# EAGLE design pc_healthypi_move_finger_sensor_v1 (EAGLE 9.6.2)
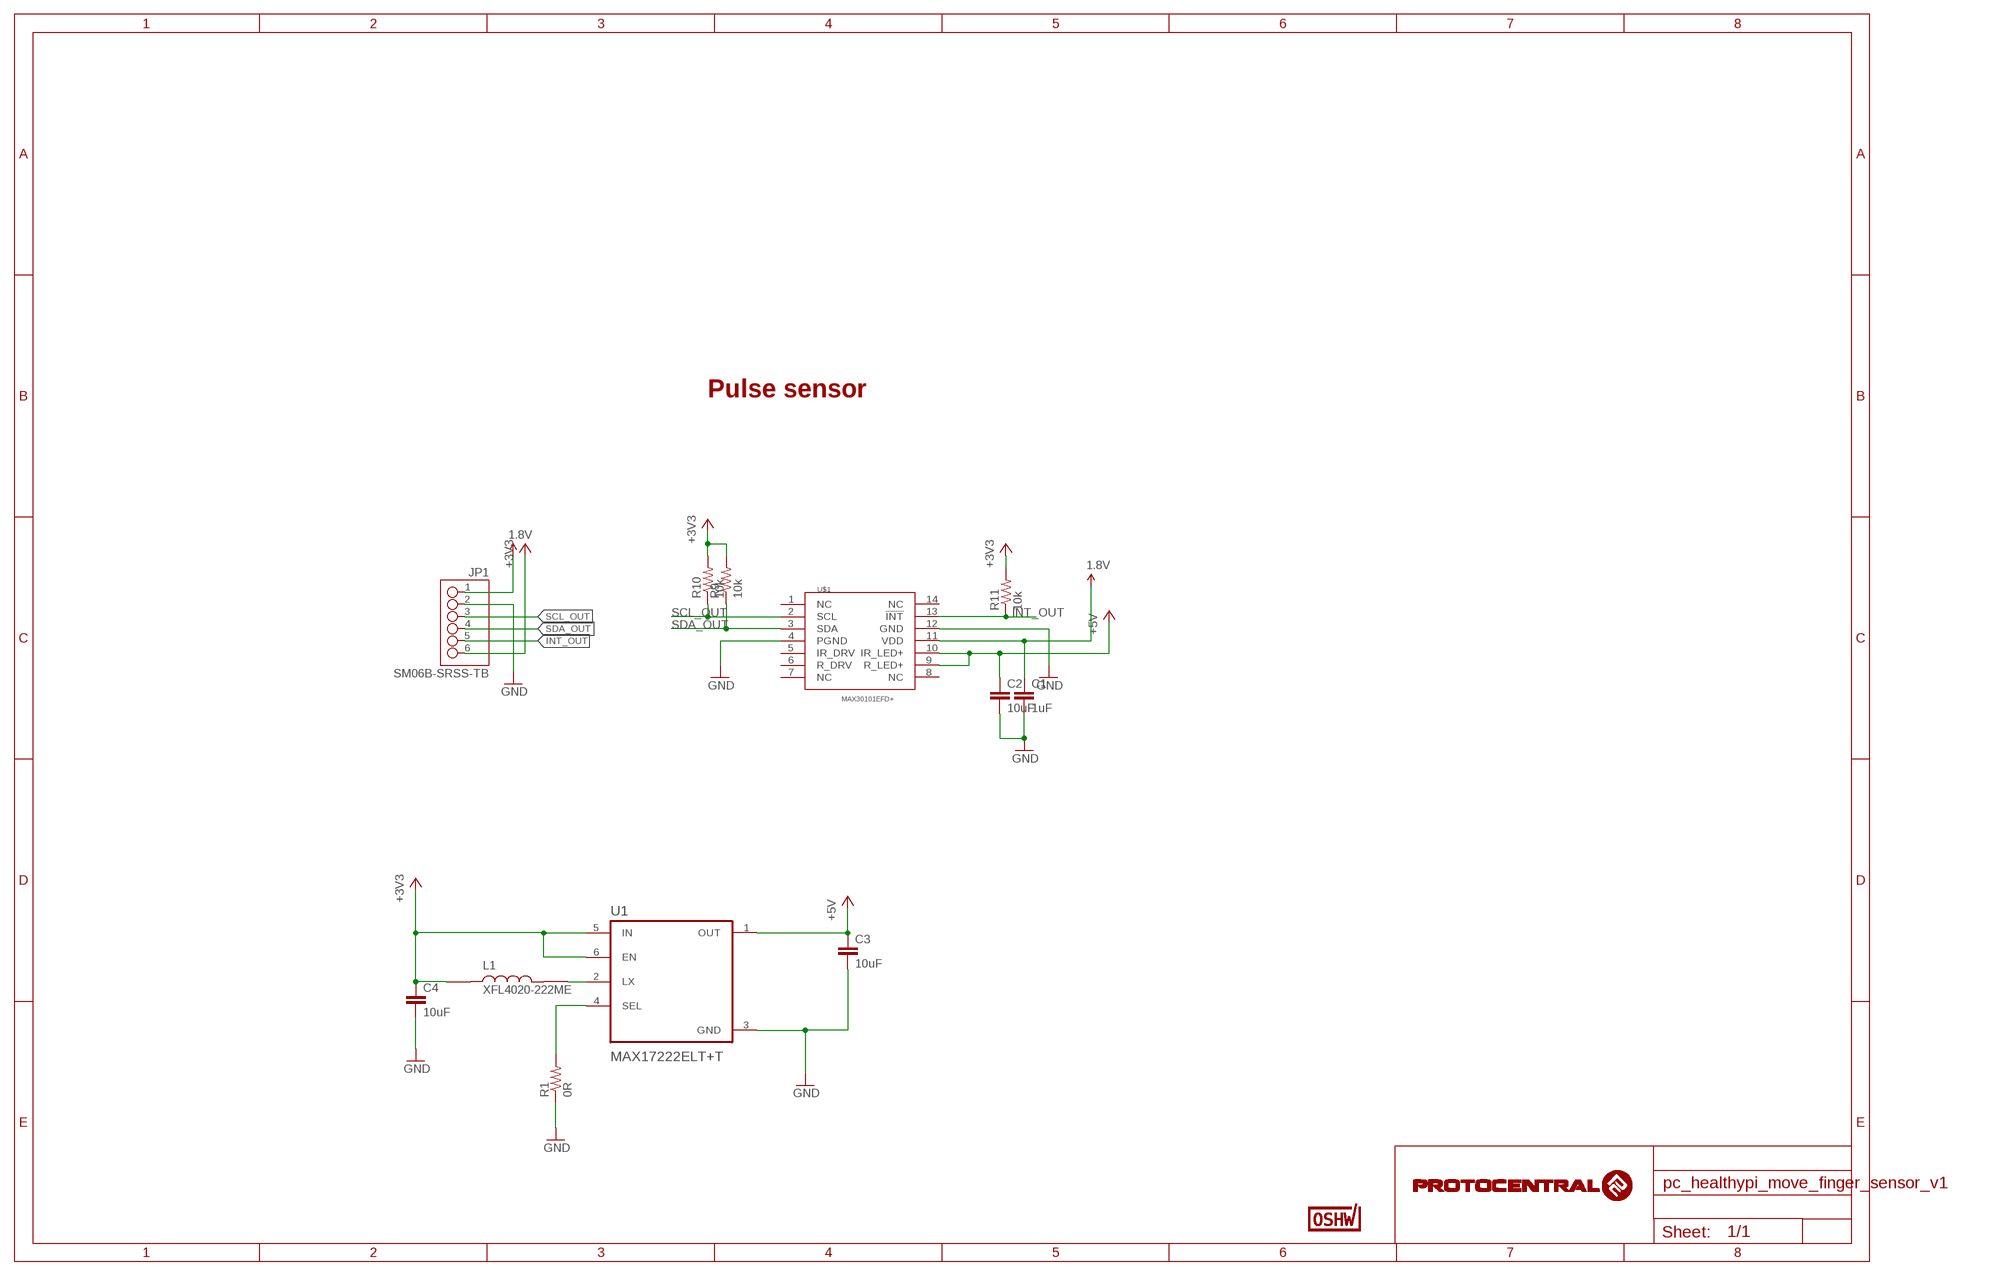
[diagram p0: schematic, sheet 1]

## Parts
C1  1uF  C-EUC0402  [C0402]
C2  10uF  C-EUC0402  [C0402]
C3  10uF  C-EUC0402  [C0402]
C4  10uF  C-EUC0402  [C0402]
JP1  SM06B-SRSS-TB  [SM06B-SRSS-TB]
L1  XFL4020-222ME  [IND_XFL4020-222ME]
R1  0R  R-US_R0402  [R0402]
R9  10k  R-US_R0402  [R0402]
R10  10k  R-US_R0402  [R0402]
R11  10k  R-US_R0402  [R0402]
U1  MAX17222ELT+T  [SON65P200X200X80-6N]
U$1  MAX30101EFD+  MAX30100  [OESIP-14]
U$9  CERT-SMALL  [CERT-SMALL-SILK]

## Nets
1.8V: C1.1 JP1.1 U$1.11(VDD)
+3V3: C4.1 JP1.6 L1.1 R9.2 R10.2 R11.2 U1.5(IN) U1.6(EN)
+5V: C2.1 C3.1 U1.1(OUT) U$1.9(R_LED+) U$1.10(IR_LED+)
GND: C1.2 C2.2 C3.2 C4.2 JP1.2 R1.1 U1.3(GND) U$1.4(PGND) U$1.12(GND)
INT_OUT: JP1.5 R11.1 U$1.13(!INT)
N$1: R1.2 U1.4(SEL)
N$2: L1.2 U1.2(LX)
SCL_OUT: JP1.3 R10.1 U$1.2(SCL)
SDA_OUT: JP1.4 R9.1 U$1.3(SDA)
Unconnected: U$1.1(NC) U$1.5(IR_DRV) U$1.6(R_DRV) U$1.7(NC) U$1.8(NC) U$1.14(NC)

## Notes on the sheet
- Pulse sensor

## Library data of the parts
C1-C4 = rcl:C-EU: CAPACITOR, European symbol; SPICEPREFIX: C
JP1 = circuitects:SM06B-SRSS-TB: Check availability <https://pricing.snapeda.com/parts/SM06B-SRSS-TB/JST%20Sales/view-part?ref=eda>; AVAILABILITY: In Stock; CHECK_PRICES: https://www.snapeda.com/parts/SM06B-SRSS-TB/JST+Sales+America+Inc./view-part/?ref=eda; DESCRIPTION: Connector Header Surface Mount, Right Angle 6 position 0.039 (1.00mm); MF: JST Sales; MP: SM06B-SRSS-TB; PACKAGE: None; PRICE: None; PURCHASE-URL: https://www.snapeda.com/api/url_track_click_mouser/?unipart_id=555083&manufacturer=JST Sales&part_name=SM06B-SRSS-TB&search_term=sm06b-srss-tb; SNAPEDA_LINK: https://www.snapeda.com/parts/SM06B-SRSS-TB/JST+Sales+America+Inc./view-part/?ref=snap
L1 = circuitects:XFL4020-222ME: Power inductor, shielded, 20% tol, SMT, RoHS, halogen free Check availability <https://pricing.snapeda.com/parts/XFL4020-222ME/Coilcraft/view-part?ref=eda>; AVAILABILITY: In Stock; CHECK_PRICES: https://www.snapeda.com/parts/XFL4020-222ME/Coilcraft/view-part/?ref=eda; DESCRIPTION: Power inductor, shielded, 20% tol, SMT, RoHS, halogen free; MF: Coilcraft; MP: XFL4020-222ME; PACKAGE: None; PRICE: None; SNAPEDA_LINK: https://www.snapeda.com/parts/XFL4020-222ME/Coilcraft/view-part/?ref=snap
R1 R9-R11 = rcl:R-US_: RESISTOR, American symbol; SPICEPREFIX: R
U1 = circuitects:MAX17222ELT+T: Check availability <https://pricing.snapeda.com/parts/MAX17222ELT%2BT/Analog%20Devices/view-part?ref=eda>; AVAILABILITY: In Stock; CHECK_PRICES: https://www.snapeda.com/parts/MAX17222ELT+T/Analog+Devices/view-part/?ref=eda; DESCRIPTION: 400mV to 5.5V Input, nanoPower Synchronous Boost Converter with True Shutdown; MF: Analog Devices; MP: MAX17222ELT+T; PACKAGE: uDFN-6 Maxim; PRICE: None; PURCHASE-URL: https://www.snapeda.com/api/url_track_click_mouser/?unipart_id=2779660&manufacturer=Analog Devices&part_name=MAX17222ELT+T&search_term= max17222elt+t; SNAPEDA_LINK: https://www.snapeda.com/parts/MAX17222ELT+T/Analog+Devices/view-part/?ref=snap
U$1 = circuitects:MAX30100
U$9 = OSHWA:CERT

## Net classes
2 gnd: width 0.102 mm, drill 0.1 mm

## Board
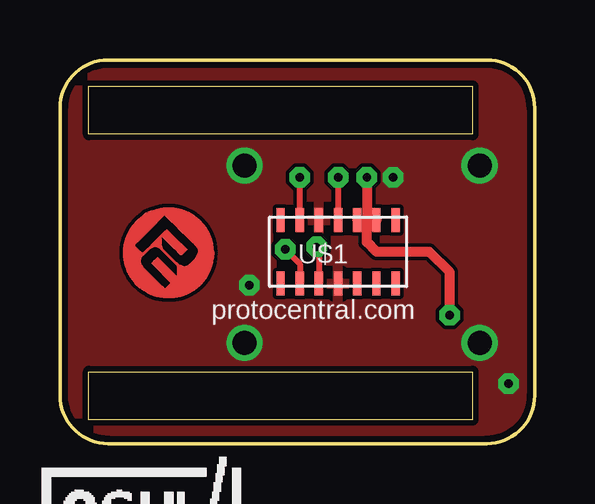
[diagram p1: board, top side]
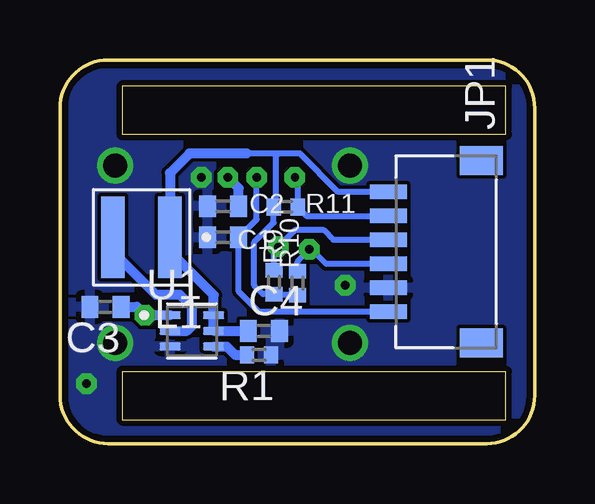
[diagram p2: board, bottom side, seen from below]

Size 19.8 x 16 mm. Coordinates in mm from the lower left corner, seen from the top.
Outline: 2,0 17.8,0 arc90 19.8,2 19.8,14 arc90 17.8,16 2,16 arc90 0,14 0,2 arc90 2,0
Outline: 1.2,14.9 17.2,14.9 17.2,12.9 1.2,12.9 1.2,14.9
Outline: 1.2,3 17.2,3 17.2,1 1.2,1 1.2,3
Copper layers (1*2*15*16): Top 0.035mm / dielectric 1.5mm / Route2 0.035mm / dielectric 0.15mm / Route15 0.035mm / dielectric 0.2mm / Bottom 0.035mm
Design rules "Circuitects-Rules": minimum track width 6mil, minimum drill 0.3mm, track to track 6mil, track to pad 6mil, pad to pad 6mil, via to via 6mil, smd to smd 6mil, copper to edge 10mil, drill to drill 8mil, minimum pad ring 12mil, minimum via ring 10mil, stop-mask expansion 4mil, vias tented up to drill 25mil, thermal gap 10mil

### Footprints (pad centres in the part's own frame; a part is rotated, then mirrored left to right if it is on the bottom)
C0402 = smd 0.7 x 0.9: 1 -0.65,0; 2 0.65,0
SM06B-SRSS-TB = smd 0.6 x 1.55: 1 -2.5,0; 2 -1.5,0; 3 -0.5,0; 4 0.5,0; 5 1.5,0; 6 2.5,0 | smd 1.2 x 1.8: P-MOUNT1 -3.8,-3.875; P-MOUNT2 3.8,-3.875
IND_XFL4020-222ME = smd 0.98 x 3.4: 1 -1.185,0; 2 1.185,0
R0402 = smd 0.6 x 0.7: 1 -0.5,0; 2 0.5,0
SON65P200X200X80-6N = smd 0.88 x 0.32: 1 -0.91,0.65; 2 -0.91,0; 3 -0.91,-0.65; 4 0.91,-0.65; 5 0.91,0; 6 0.91,0.65
OESIP-14 = smd 1 x 0.35: 1 -1.325,2.4; 2 -1.325,1.6; 3 -1.325,0.8; 4 -1.325,0; 5 -1.325,-0.8; 6 -1.325,-1.6; 7 -1.325,-2.4; 8 1.325,-2.4; 9 1.325,-1.6; 10 1.325,-0.8; 11 1.325,0; 12 1.325,0.8; 13 1.325,1.6; 14 1.325,2.4

### Placement (x,y rotation side)
C1  13,8.6 180 bottom
C2  13,9.9 180 bottom
C3  17.9,5.7 180 bottom
C4  11.3,4.7 0 bottom
JP1  6.1,8 90 bottom
L1  16.4,8.6 180 bottom
R1  11.5,3.7 180 bottom
R9  10.87,6.73 270 bottom
R10  9.89,6.69 270 bottom
R11  10.39,9.87 180 bottom
U1  14.3,4.7 0 bottom
U$1  11.6,8 90 top
U$9  3.4,-4.9 0 top  (outside the outline)
U$15  [PCROUNDLOGO_GOLD]  1.7,5.7 0 top

### Tracks (layer width: path | path; a pad name or v marks a point on that pad's centre or on a via)
1.8V  (via drill 0.35)
  Top 0.254: v11.6,11.1 U$1.11
  Bottom 0.254: v11.6,11.1 11.6,9.35 C1.1 12.35,6.35 11.5,5.5 JP1.1
+3V3
  Bottom 0.254: R10.2 10.83,6.19 R9.2 11.33,6.23 11.7,6.6 11.7,8.4 10.89,9.21 R11.2 10.8,9.96 10.8,12 10.7,12.1 | JP1.6 8.2,10.5 9.8,12.1 10.7,12.1 | 10.7,12.1 12,12.1
  Bottom 0.406: 12,12.1 14.4,12.1 15.21,11.29 L1.1 15.21,8.02 13.39,6.19 U1.6 U1.5 C4.1
+5V  (via drill 0.35)
  Top 0.406: v16.25,5.35 16.25,7.15 15.4,8 13.2,8 12.8,8.4 12.8,8.93 | 12.8,8.93 12.51,9.21 | 12.51,9.21 U$1.10 | 12.8,9.21 13.09,9.21 U$1.9 12.8,8.93 | 12.8,9.21 12.51,9.21 | v12.8,11.1 12.8,9.21
  Bottom 0.406: U1.1 16.15,5.35 16.2,5.4 v16.25,5.35 16.6,5.7 C3.1 | C2.1 12.35,10.65 v12.8,11.1
GND  (via drill 0.35, 1)
  other vias: 7.9,6.6 18.7,2.5 7.7,11.6 7.7,4.2 17.5,4.2 17.5,11.6 13.9,11.1
  pour Top: -0.54,16 20.7,16 20.7,-0.23 -0.2,0
  pour Bottom: -0.55,16 20.7,16 20.7,-0.24 -0.19,0
INT_OUT  (via drill 0.35)
  Top 0.254: U$1.13 v10,11.1
  Bottom 0.254: v10,11.1 9.89,10.99 R11.1 9.52,9.5 JP1.5
N$1
  Bottom 0.406: U1.4 12.85,4.05 12.5,3.7 R1.2
N$2
  Bottom 0.406: U1.2 14.5,4.7 14.3,4.9 14.3,5.7 14.8,6.2 15.8,6.2 17.5,7.9 17.59,7.9 L1.2
SCL_OUT  (via drill 0.35)
  Top 0.254: v9.4,8.1 10,7.5 U$1.2
  Bottom 0.254: R10.1 9.89,7.59 9.4,8.08 v9.4,8.1 9.4,8.2 8.7,7.5 JP1.3
SDA_OUT  (via drill 0.35)
  Top 0.254: v10.7,8.2 10.8,8.1 U$1.3
  Bottom 0.254: R9.1 10.87,8.03 v10.7,8.2 10,8.9 8.8,8.9 8.4,8.5 JP1.4

### Text on the board
tPlace: protocentral.com